# EAGLE design Tahu (EAGLE 7.6.0)
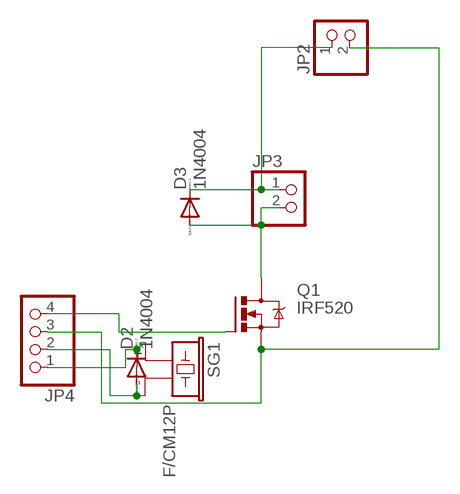
[diagram p0: schematic, sheet 1]

## Parts
D2  1N4004  [DO41-10]
D3  1N4004  [DO41-10]
JP2  PINHD-1X2  [1X02]
JP3  PINHD-1X2  [1X02]
JP4  PINHD-1X4  [1X04]
Q1  IRF520  [TO220BV]
SG1  F/CM12P  [F/CM12P]

## Nets
5V: D2.C JP4.1 SG1.+
24V: D3.C JP2.1 JP3.1
GND: JP2.2 JP4.3 Q1.S
N$1: D2.A JP4.2 SG1.-
N$2: JP4.4 Q1.G
N$4: D3.A JP3.2 Q1.D

## Library data of the parts
D2 D3 = diode:1N4004: DIODE general purpose rectifier, 1 A
JP2 JP3 = pinhead:PINHD-1X2: PIN HEADER
JP4 = pinhead:PINHD-1X4: PIN HEADER
Q1 = transistor-power:IRF520: HEXFET Power MOSFET
SG1 = buzzer:F/CM12P: BUZZER Source: Buerklin; OC_FARNELL: unknown; OC_NEWARK: unknown

## Board
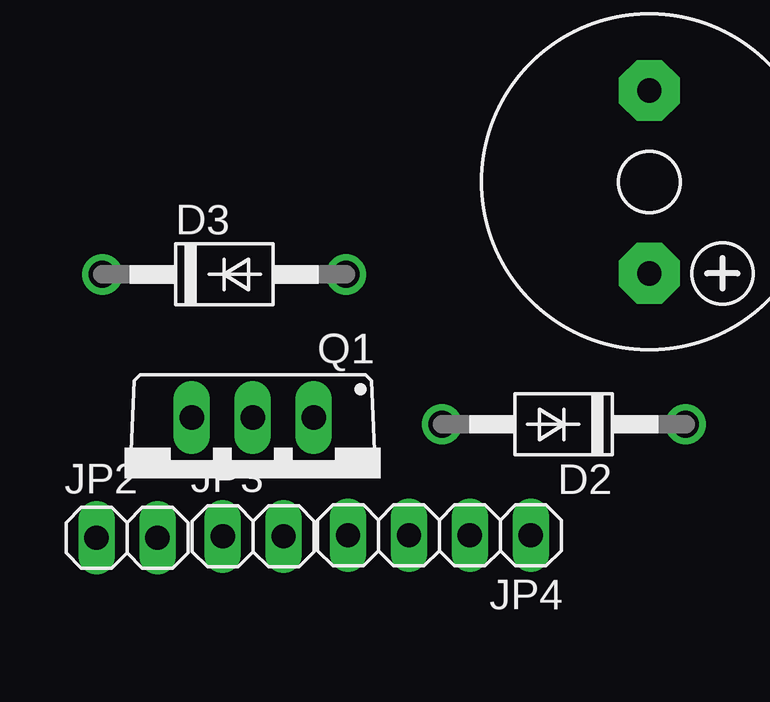
[diagram p1: board, top side]
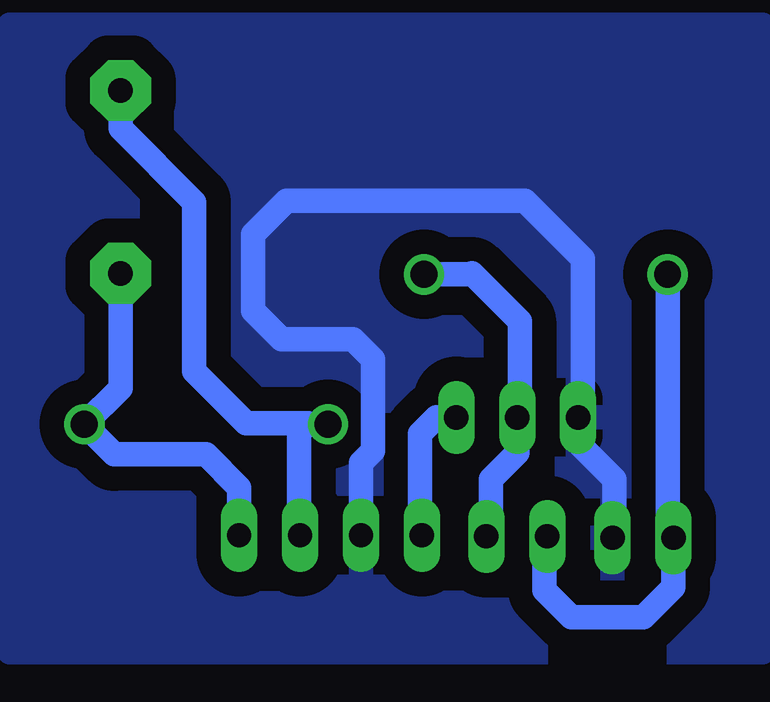
[diagram p2: board, bottom side, seen from below]

No outline drawn. Coordinates in mm, seen from the top.
Copper layers (1*16): Top 0.035mm / dielectric 1.5mm / Bottom 0.035mm
Design rules "default": minimum track width 10mil, minimum drill 24mil, track to track 8mil, track to pad 8mil, pad to pad 8mil, via to via 8mil, smd to smd 8mil, copper to edge 40mil, drill to drill 8mil, minimum pad ring 10mil, minimum via ring 8mil, stop-mask expansion 4mil, vias tented up to drill 0mil, thermal gap 10mil

### Footprints (pad centres in the part's own frame; a part is rotated, then mirrored left to right if it is on the bottom)
DO41-10 = drill 1.118: A 5.08,0; C -5.08,0
1X02 = drill 1.016 long: 1 -1.27,0; 2 1.27,0
1X04 = drill 1.016 long: 1 -3.81,0; 2 -1.27,0; 3 1.27,0; 4 3.81,0
TO220BV = drill 1.016 long: D 0,-2.54; G -2.54,-2.54; S 2.54,-2.54
F/CM12P = drill 1.016 pad 2.54 octagon: + 3.81,0; - -3.81,0

### Placement (x,y rotation side)
D2  26.94,10.22 180 top
D3  12.78,16.47 0 top
JP2  8.72,5.5 0 top
JP3  13.98,5.56 0 top
JP4  21.75,5.6 180 top
Q1  13.97,7.97 180 top
SG1  30.5,20.32 270 top

### Tracks (layer width: path | path; a pad name or v marks a point on that pad's centre or on a via)
5V
  Bottom 1.016: SG1.+ 30.5,11.73 D2.C 30.76,8.97 26.94,8.97 25.56,7.59 JP4.1
24V
  Bottom 1.016: JP2.1 7.46,4.39 | 7.46,4.39 7.46,3.44 8.71,2.19 11.71,2.19 12.83,3.31 12.83,5.44 JP3.1 | D3.C 7.7,4.63 7.46,4.39
GND
  Bottom 1.016: JP2.2 9.91,5.58 9.91,7.94 11.43,9.46 Q1.S 11.24,11.62 11.24,17.13 13.64,19.53 23.59,19.53 24.98,18.14 24.98,14.95 23.8,13.76 20.81,13.76 19.98,12.94 19.98,9.12 20.48,8.62 JP4.3
  pour Bottom (isolate 1.016): 3.73,26.88 35.15,26.88 35.15,0.72 3.73,0.72
N$1
  Bottom 1.016: D2.A 22.62,10.22 | 22.62,10.22 22.71,10.22 23.06,9.87 23.06,5.64 JP4.2 | SG1.- 30.5,22.55 27.44,19.48 27.44,12.43 25.28,10.27 22.66,10.27 22.62,10.22
N$2
  Bottom 1.016: Q1.G 17.34,10.51 18.02,9.83 18.02,5.68 JP4.4
N$4
  Bottom 1.016: JP3.2 15.06,5.75 15.06,7.94 13.97,9.03 Q1.D 13.86,11.54 13.86,14.51 15.86,16.51 15.9,16.47 D3.A